# Altium project Flat Project.PrjPcb
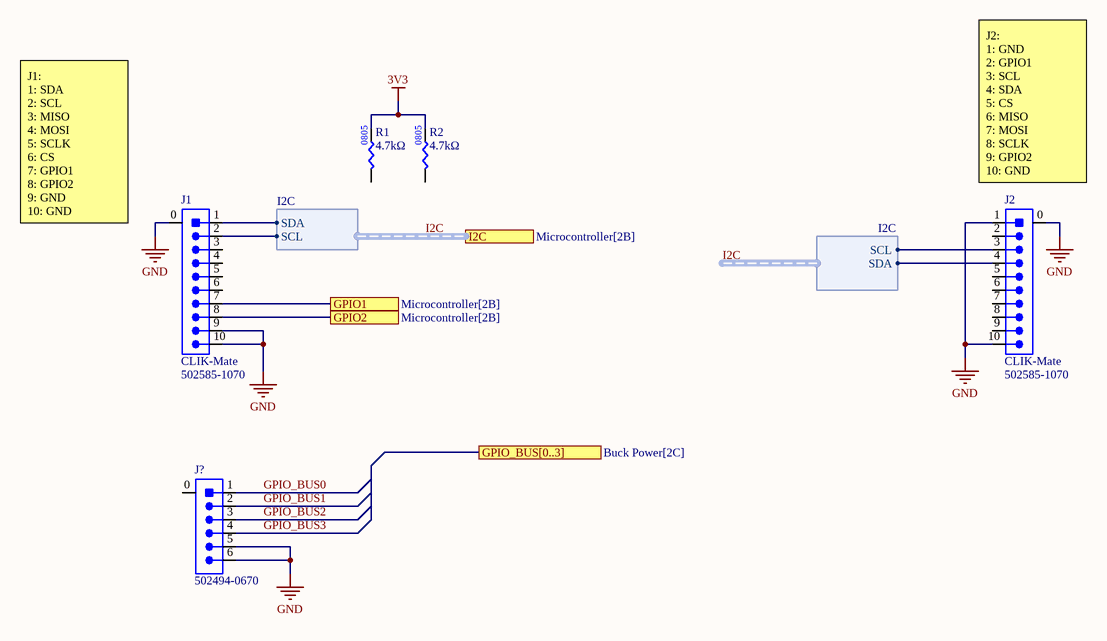
[diagram p0: Net Names 2.SchDoc]
2 sheets, 6 parts. Net scope: flat (ports and power ports of the same name join across sheets).
Board file: Flat Project.PcbDoc
Sheets:
  Net Names 2.SchDoc
  Microcontroller.SchDoc

## Sheet Net Names 2.SchDoc
size A4; SheetNumber: 2; SheetTotal: 3

### Parts
J1  Family: CLIK-Mate  Manufacturer Part Number 1: 502585-1070  [MOLEX-5025851070]  (hidden comment: CON_10M_SM_RA)
J2  Family: CLIK-Mate  Manufacturer Part Number 1: 502585-1070  [MOLEX-5025851070]  (hidden comment: CON_10M_SM_RA)
J?  Manufacturer Part Number 1: 502494-0670  [MOLEX-5024940670]  (hidden comment: CON_6M_SM_RA)
R1  value 4.7kΩ  [RES0805]  (hidden comment: RES_4.7kΩ_0805_5%)
R2  value 4.7kΩ  [RES0805]  (hidden comment: RES_4.7kΩ_0805_5%)

### Ports
GPIO1 (see Microcontroller[2B]), GPIO2 (see Microcontroller[2B]), GPIO_BUS[0..3] (see Buck Power[2C]), I2C (harness I2C, see Microcontroller[2B])

### Harnesses
I2C: SDA, SCL

### Nets
3V3: R1.2 R2.2
GND: J1.0 J1.9 J1.10 J2.0 J2.1 J2.10 J?.5 J?.6
GPIO_BUS0: J?.1
GPIO_BUS1: J?.2
GPIO_BUS2: J?.3
GPIO_BUS3: J?.4
I2C.SCL: J1.2 J2.3 ; port I2C.SCL
I2C.SDA: J1.1 J2.4 ; port I2C.SDA
NetJ1_7: J1.7 ; port GPIO1
NetJ1_8: J1.8 ; port GPIO2

Not connected (* = marked no-connect by the designer): J1 3 4 5 6; J2 2 5 6 7(6) 8(6) 9; J? 0; R1 1; R2 1

### Buses and harness runs
harness I2C = port I2C

### Notes on the sheet
- (near J2) J2:
  1: GND
  2: GPIO1
  3: SCL
  4: SDA
  5: CS
  6: MISO
  7: MOSI
  8: SCLK
  9: GPIO2
  10: GND
- J1:
  1: SDA
  2: SCL
  3: MISO
  4: MOSI
  5: SCLK
  6: CS
  7: GPIO1
  8: GPIO2
  9: GND
  10: GND

### Library data of the parts
J1 J2 = CON_10M_SM_RA: CONN HEADER SMD RIGHT ANGLE 1.5 MM PITCH; Manufacturer 1: Molex; Current Rating: 2A; Voltage Rating: 100V; Pitch: 1.5mm; Supplier 1: Digi-Key; Supplier Part Number 1: WM14472CT-ND; Orientation: Right Angle
J? = CON_6M_SM_RA: CONN HEADER SMD RIGHT ANGLE 2MM PITCH; Manufacturer 1: Molex; Current Rating: 3A; Voltage Rating: 250V; Supplier 1: Digi-Key; Orientation: Right Angle; Pitch: 2mm; Supplier Part Number 1: WM2283CT-ND
R1 R2 = RES_4.7kΩ_0805_5%: RES 4.7K OHM 5% 1/8W 0805; Manufacturer 1: Yageo; Manufacturer Part Number 1: RC0805JR-074K7L; Supplier 1: Digi-Key; Supplier Part Number 1: 311-4.7KARCT-ND; Mounting Type: SMD; LCSC Part #: C17673; Package: 0805

## Sheet Microcontroller.SchDoc
size A4; SheetNumber: 3; SheetTotal: 3
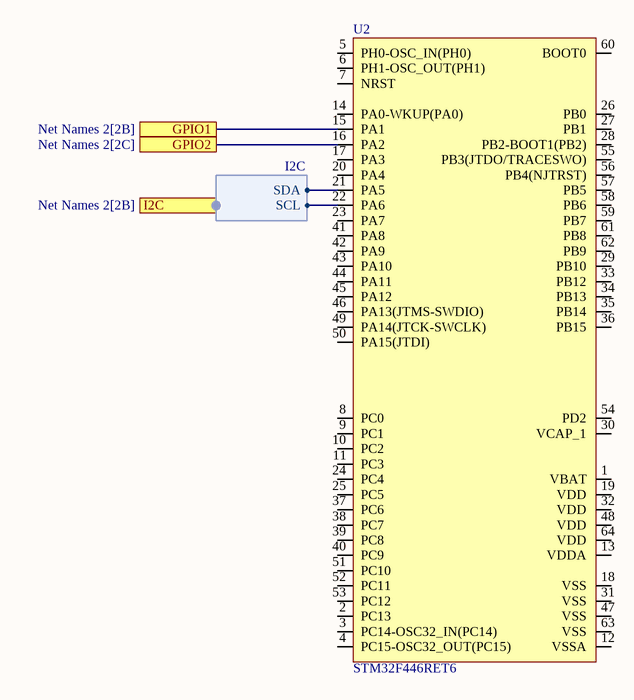
[diagram p1: Microcontroller.SchDoc]

### Parts
U2  STM32F446RET6  [STM_LQFP64_N]

### Ports
GPIO1 (see Net Names 2[2B]), GPIO2 (see Net Names 2[2C]), I2C (harness I2C, see Net Names 2[2B])

### Harnesses
I2C: SDA, SCL

### Nets
I2C.SCL: U2.22(PA6) ; port I2C.SCL
I2C.SDA: U2.21(PA5) ; port I2C.SDA
NetJ1_7: U2.15(PA1) ; port GPIO1
NetJ1_8: U2.16(PA2) ; port GPIO2

Not connected (* = marked no-connect by the designer): U2 1(VBAT) 2(PC13) 3(PC14-OSC32_IN(PC14)) 4(PC15-OSC32_OUT(PC15)) 5(PH0-OSC_IN(PH0)) 6(PH1-OSC_OUT(PH1)) 7(NRST) 8(PC0) 9(PC1) 10(PC2) 11(PC3) 12(VSSA) 13(VDDA) 14(PA0-WKUP(PA0)) 17(PA3) 18(VSS) 19(VDD) 20(PA4) 23(PA7) 24(PC4) 25(PC5) 26(PB0) 27(PB1) 28(PB2-BOOT1(PB2)) 29(PB10) 30(VCAP_1) 31(VSS) 32(VDD) 33(PB12) 34(PB13) 35(PB14) 36(PB15) 37(PC6) 38(PC7) 39(PC8) 40(PC9) 41(PA8) 42(PA9) 43(PA10) 44(PA11) 45(PA12) 46(PA13(JTMS-SWDIO)) 47(VSS) 48(VDD) 49(PA14(JTCK-SWCLK)) 50(PA15(JTDI)) 51(PC10) 52(PC11) 53(PC12) 54(PD2) 55(PB3(JTDO/TRACESWO)) 56(PB4(NJTRST)) 57(PB5) 58(PB6) 59(PB7) 60(BOOT0) 61(PB8) 62(PB9) 63(VSS) 64(VDD)

### Library data of the parts
U2 = STM32F446RET6: IC MCU 32BIT 512KB FLASH 64LQFP; Manufacturer 1: STMicroelectronics; Manufacturer Part Number 1: LF80CDT-TR; Supplier 1: Digi-Key; Supplier Part Number 1: 497-15376-ND

## Nets that join several sheets
I2C.SCL: Net Names 2 (J1.2 J2.3), Microcontroller (U2.22)
I2C.SDA: Net Names 2 (J1.1 J2.4), Microcontroller (U2.21)
NetJ1_7: Net Names 2 (J1.7), Microcontroller (U2.15)
NetJ1_8: Net Names 2 (J1.8), Microcontroller (U2.16)